# Altium schematic sheet Sheet3.SchDoc
size A3; DocumentNumber: 3; SheetNumber: 3; SheetTotal: 7
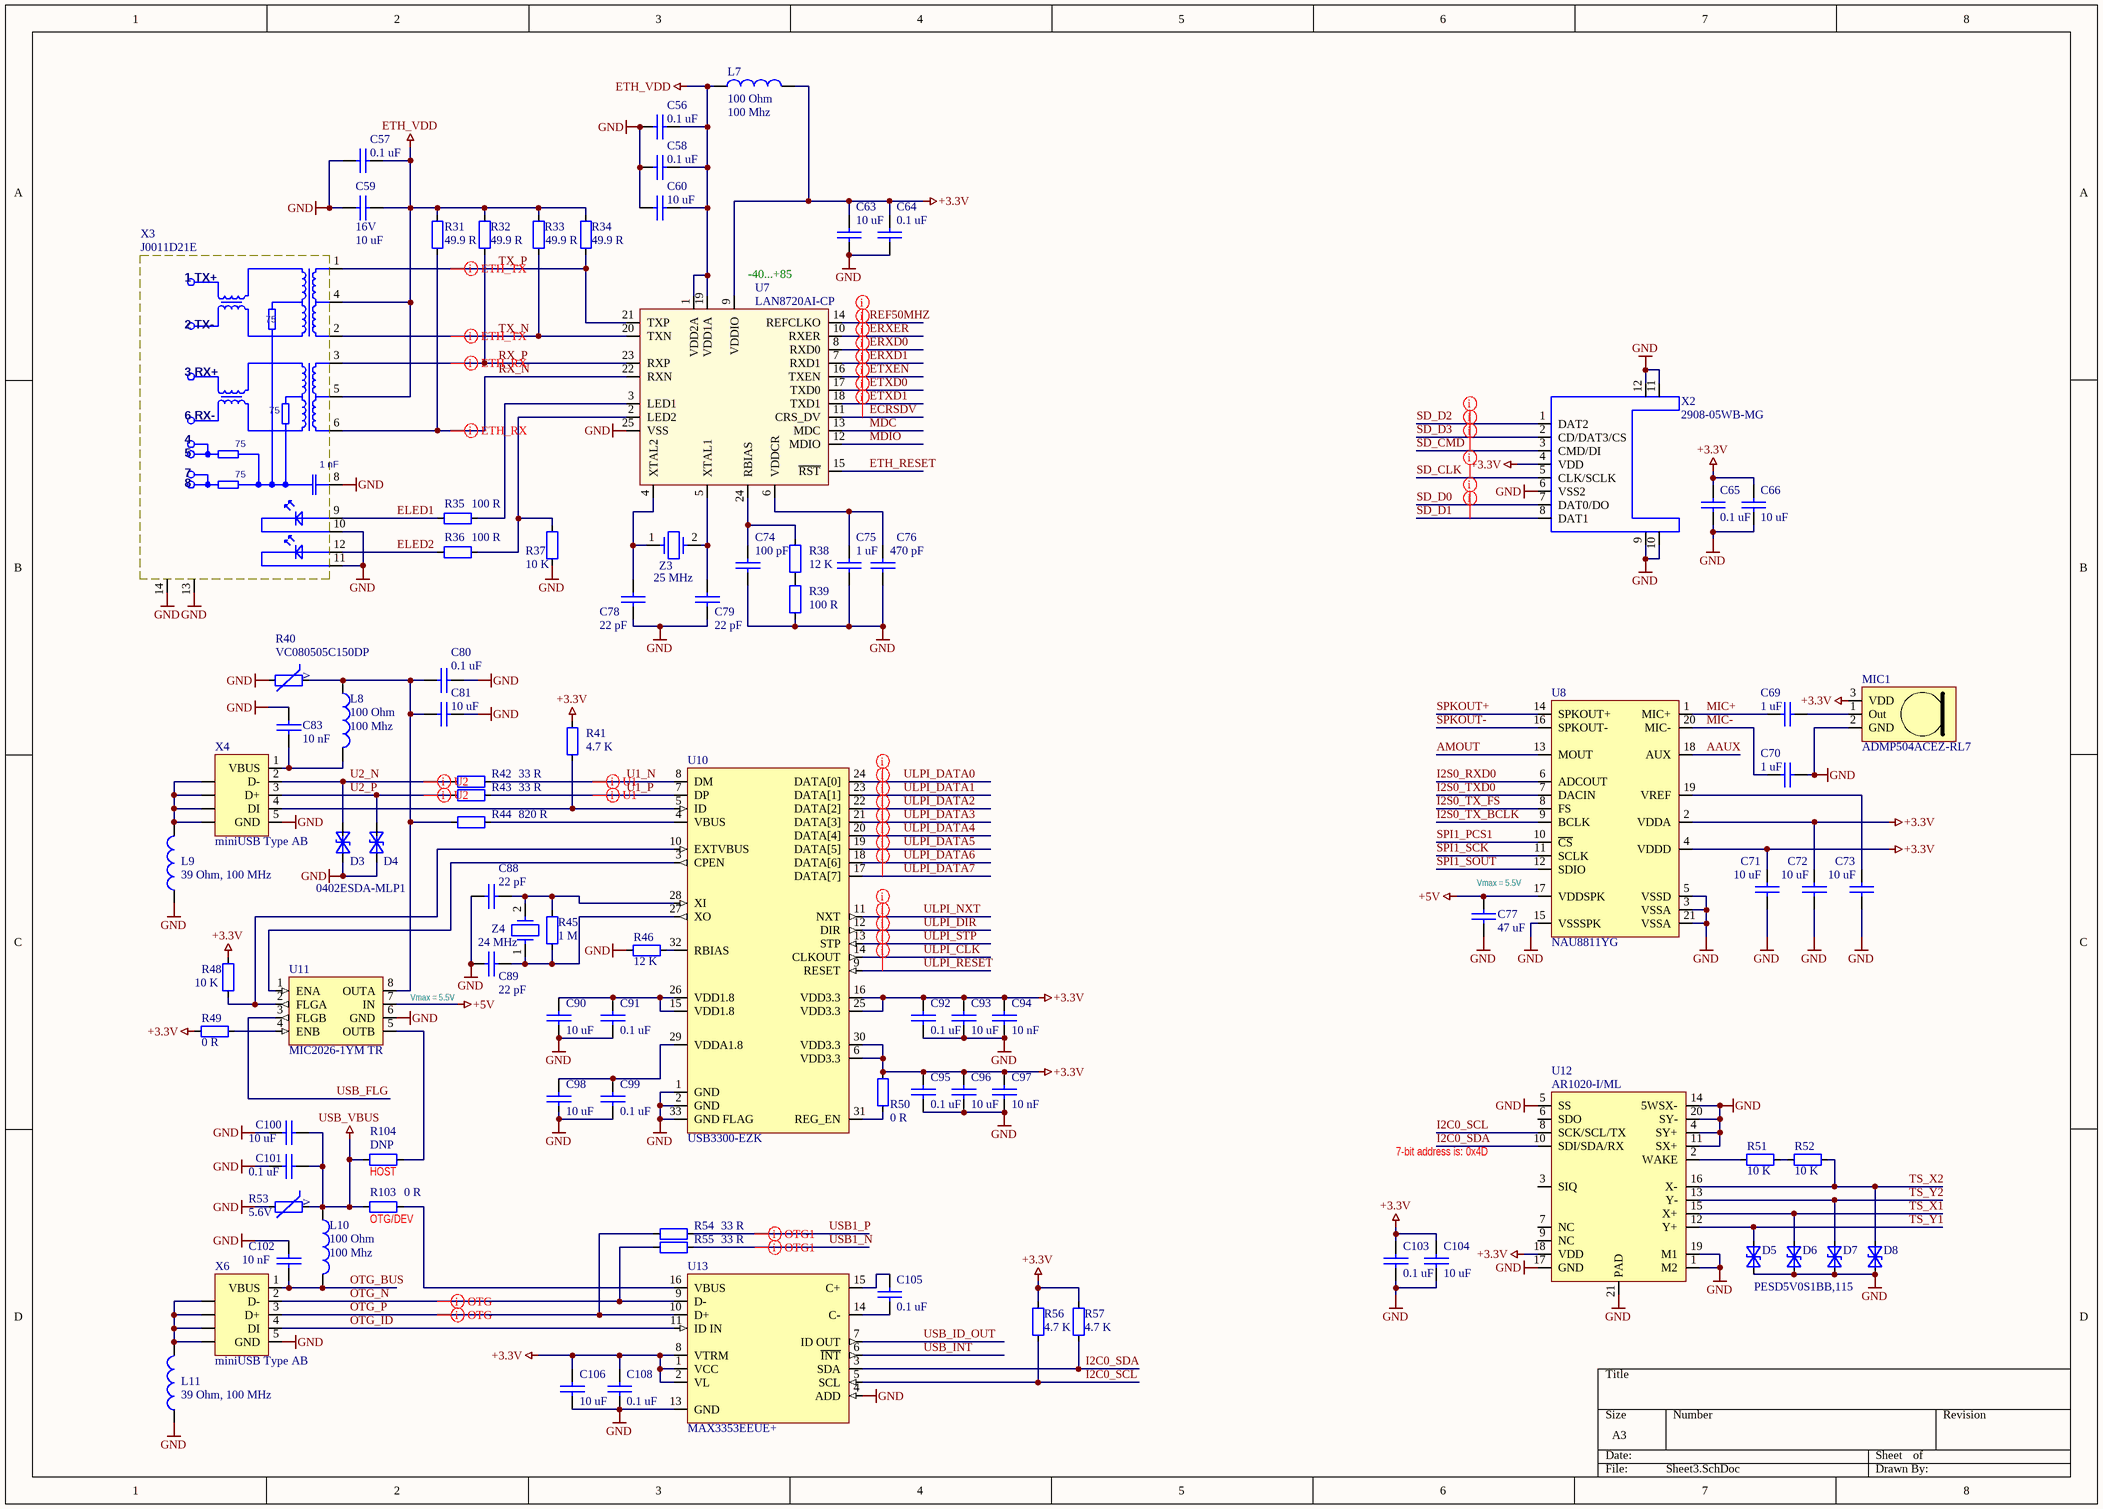
[diagram p0: Sheet3.SchDoc]

## Parts
C56  value 0.1 uF  [1608[0603]]  (hidden comment: CL10B104KA8NNND)
C57  value 0.1 uF  [1608[0603]]  (hidden comment: CL10B104KA8NNND)
C58  value 0.1 uF  [1608[0603]]  (hidden comment: CL10B104KA8NNND)
C59  value 10 uF  Voltage: 16V  [2012[0805]]  (hidden comment: C2012X5R1C106K085AC)
C60  value 10 uF  [2012[0805]]  (hidden comment: C2012X5R1C106K085AC)
C63  value 10 uF  [2012[0805]]  (hidden comment: C2012X5R1C106K085AC)
C64  value 0.1 uF  [1608[0603]]  (hidden comment: CL10B104KA8NNND)
C65  value 0.1 uF  [1608[0603]]  (hidden comment: CL10B104KA8NNND)
C66  value 10 uF  [2012[0805]]  (hidden comment: C2012X5R1C106K085AC)
C69  value 1 uF  [2012[0805]]  (hidden comment: GRM21BR71A105KA01L)
C70  value 1 uF  [2012[0805]]  (hidden comment: GRM21BR71A105KA01L)
C71  value 10 uF  [0805-1206]  (hidden comment: LMK212F106ZG-T)
C72  value 10 uF  [0805-1206]  (hidden comment: LMK212F106ZG-T)
C73  value 10 uF  [0805-1206]  (hidden comment: LMK212F106ZG-T)
C74  value 100 pF  [1608[0603]]  (hidden comment: CL10C101JB8NNNC)
C75  value 1 uF  [1608[0603]]  (hidden comment: CL10A105KO8NNNC)
C76  value 470 pF  [1608[0603]]  (hidden comment: CL10C471JB8NNNC)
C77  value 47 uF  [3225[1210]]  (hidden comment: GRM32ER71A476KE15L)
C78  value 22 pF  [1608[0603]]  (hidden comment: 0603N220J500CT)
C79  value 22 pF  [1608[0603]]  (hidden comment: 0603N220J500CT)
C80  value 0.1 uF  [1608[0603]]  (hidden comment: CL10B104KA8NNND)
C81  value 10 uF  [2012[0805]]  (hidden comment: C2012X5R1C106K085AC)
C83  value 10 nF  [1608[0603]]  (hidden comment: CL10B103JB8NNNC)
C88  value 22 pF  [1608[0603]]  (hidden comment: 0603N220J500CT)
C89  value 22 pF  [1608[0603]]  (hidden comment: 0603N220J500CT)
C90  value 10 uF  [2012[0805]]  (hidden comment: C2012X5R1C106K085AC)
C91  value 0.1 uF  [1608[0603]]  (hidden comment: CL10B104KA8NNND)
C92  value 0.1 uF  [1608[0603]]  (hidden comment: CL10B104KA8NNND)
C93  value 10 uF  [2012[0805]]  (hidden comment: C2012X5R1C106K085AC)
C94  value 10 nF  [1005[0402]]  (hidden comment: CL05B103KB5NNNC)
C95  value 0.1 uF  [1608[0603]]  (hidden comment: CL10B104KA8NNND)
C96  value 10 uF  [2012[0805]]  (hidden comment: C2012X5R1C106K085AC)
C97  value 10 nF  [1005[0402]]  (hidden comment: CL05B103KB5NNNC)
C98  value 10 uF  [2012[0805]]  (hidden comment: C2012X5R1C106K085AC)
C99  value 0.1 uF  [1608[0603]]  (hidden comment: CL10B104KA8NNND)
C100  value 10 uF  [2012[0805]]  (hidden comment: C2012X5R1C106K085AC)
C101  value 0.1 uF  [1608[0603]]  (hidden comment: CL10B104KA8NNND)
C102  value 10 nF  [1608[0603]]  (hidden comment: CL10B103JB8NNNC)
C103  value 0.1 uF  [1608[0603]]  (hidden comment: CL10B104KA8NNND)
C104  value 10 uF  [2012[0805]]  (hidden comment: C2012X5R1C106K085AC)
C105  value 0.1 uF  [1608[0603]]  (hidden comment: CL10B104KA8NNND)
C106  value 10 uF  [2012[0805]]  (hidden comment: C2012X5R1C106K085AC)
C108  value 0.1 uF  [1608[0603]]  (hidden comment: CL10B104KA8NNND)
D3  0402ESDA-MLP1  [0402]  (value not drawn)
D4  0402ESDA-MLP1  [0402]
D5  PESD5V0S1BB,115  [SOD523]
D6  PESD5V0S1BB,115  [SOD523]  (value not drawn)
D7  PESD5V0S1BB,115  [SOD523]  (value not drawn)
D8  PESD5V0S1BB,115  [SOD523]  (value not drawn)
L7  value 100 Ohm  Freq: 100 Mhz  [0603]  (hidden comment: MPZ1608D101B)
L8  value 100 Ohm  Freq: 100 Mhz  [0603]  (hidden comment: MPZ1608D101B)
L9  value 39 Ohm, 100 MHz  [0805]  (hidden comment: EXC-ML20A390U)
L10  value 100 Ohm  Freq: 100 Mhz  [0603]  (hidden comment: MPZ1608D101B)
L11  value 39 Ohm, 100 MHz  [0805]  (hidden comment: EXC-ML20A390U)
MIC1  ADMP504ACEZ-RL7  [ADMP504ACEZ]
R31  value 49.9 R  [0603]  (hidden comment: ERJ-3EKF49R9V)
R32  value 49.9 R  [0603]  (hidden comment: ERJ-3EKF49R9V)
R33  value 49.9 R  [0603]  (hidden comment: ERJ-3EKF49R9V)
R34  value 49.9 R  [0603]  (hidden comment: ERJ-3EKF49R9V)
R35  value 100 R  [0603]  (hidden comment: ERJ-3EKF1000V)
R36  value 100 R  [0603]  (hidden comment: ERJ-3EKF1000V)
R37  value 10 K  [0603]  (hidden comment: ERJ-3EKF1002V)
R38  value 12 K  [0603]  (hidden comment: RC0603FR-0712KL)
R39  value 100 R  [0603]  (hidden comment: ERJ-3EKF1000V)
R40  VC080505C150DP  [2012[0805]]
R41  value 4.7 K  [0603]  (hidden comment: RJ0603FRE074K7L)
R42  value 33 R  [0603]  (hidden comment: RC0603FR-0733RL)
R43  value 33 R  [0603]  (hidden comment: RC0603FR-0733RL)
R44  value 820 R  [0603]  (hidden comment: RC0603FR-07820RL)
R45  value 1 M  [0603]  (hidden comment: RC0603FR-071ML)
R46  value 12 K  [0603]  (hidden comment: RC0603FR-0712KL)
R48  value 10 K  [0603]  (hidden comment: ERJ-3EKF1002V)
R49  value 0 R  [0603]  (hidden comment: RC0603JR-070RL)
R50  value 0 R  [0603]  (hidden comment: RC0603JR-070RL)
R51  value 10 K  [0603]  (hidden comment: ERJ-3EKF1002V)
R52  value 10 K  [0603]  (hidden comment: ERJ-3EKF1002V)
R53  Voltage: 5.6V  [2012[0805]]  (hidden comment: VC080505C150DP)
R54  value 33 R  [0603]  (hidden comment: RC0603FR-0733RL)
R55  value 33 R  [0603]  (hidden comment: RC0603FR-0733RL)
R56  value 4.7 K  [0603]  (hidden comment: RJ0603FRE074K7L)
R57  value 4.7 K  [0603]  (hidden comment: RJ0603FRE074K7L)
R103  value 0 R  [0603]  (hidden comment: RC0603JR-070RL)
R104  value DNP  [0603]  (hidden comment: DNP_0603)  (no BOM)
U7  LAN8720AI-CP  [THIN QFN 24]
U8  NAU8811YG  [THIN QFN 20 W/O VIA]
U10  USB3300-EZK  [HVQFN32 NXP]
U11  MIC2026-1YM TR  [SO-8]
U12  AR1020-I/ML  [THIN QFN 20 W/O VIA]
U13  MAX3353EEUE+  [TSOP65P640-16AM]
X2  2908-05WB-MG  [2908-05WB-MG]
X3  J0011D21E  [PulseJack_J00]
X4  miniUSB Type AB  [USB AB 56579-0576 Molex]
X6  miniUSB Type AB  [USB AB 56579-0576 Molex]
Z3  value 25 MHz  [ABM3]  (hidden comment: ABM3-25.000MHZ-B2-T)
Z4  value 24 MHz  [ABM3]  (hidden comment: ABM3-24.000MHZ-B2-T)

## Nets
+3.3V: C63.2 C64.2 C65.1 C66.1 C71.2 C72.2 C92.2 C93.1 C94.2 C95.2 C96.1 C97.2 C103.1 C104.1 C106.2 C108.1 L7.2 MIC1.3(VDD) R41.2 R48.1 R49.2 R50.2 R56.2 R57.2 U7.9(VDDIO) U8.2(VDDA) U8.4(VDDD) U10.6(VDD3.3) U10.16(VDD3.3) U10.25(VDD3.3) U10.30(VDD3.3) U12.18(VDD) U13.1(VCC) U13.2(VL) U13.8(VTRM) X2.4(VDD)
+5V: C77.1 U8.17(VDDSPK) U11.7(IN)
ETH_VDD: C56.1 C57.1 C58.1 C59.1 C60.1 L7.1 R31.2 R32.2 R33.1 R34.1 U7.1(VDD2A) U7.19(VDD1A) X3.4(CT) X3.5(CT)
GND: C56.2 C57.2 C58.2 C59.2 C60.2 C63.1 C64.1 C65.2 C66.2 C70.2 C71.1 C72.1 C73.1 C74.2 C75.1 C76.2 C77.2 C78.2 C79.2 C80.2 C81.1 C83.2 C88.1 C89.1 C90.1 C91.2 C92.1 C93.2 C94.1 C95.1 C96.2 C97.1 C98.1 C99.2 C100.1 C101.2 C102.2 C103.2 C104.2 C106.1 C108.2 D3.1(C) D4.1(C) D5.2(A) D6.2(A) D7.2(A) D8.2(A) L9.1 L11.1 MIC1.2(GND) R37.2 R39.1 R40.1 R46.1 R53.1 U7.25(VSS) U8.3(VSSA) U8.5(VSSD) U8.15(VSSSPK) U8.21(VSSA) U10.1(GND) U10.2(GND) U10.33(GND_FLAG) U11.6(GND) U12.1(M2) U12.4(SY+) U12.5(SS) U12.11(SX+) U12.14(5WSX-) U12.17(GND) U12.19(M1) U12.20(SY-) U12.21(PAD) U13.4(ADD) U13.13(GND) X2.6(VSS2) X2.9 X2.10(WP) X2.11(GND) X2.12(GND) X3.8(GND) X3.10 X3.11 X3.13 X3.14 X4.5(GND) X6.5(GND)
USB_VBUS: C100.2 C101.1 L10.1 R53.2 R103.2 R104.1
AAUX: U8.18(AUX)
AMOUT: U8.13(MOUT)
ECRSDV: U7.11(CRS_DV)
ELED1: R35.1 X3.9
ELED2: R36.1 X3.12
ERXD0: U7.8(RXD0)
ERXD1: U7.7(RXD1)
ERXER: U7.10(RXER)
ETH_RESET: U7.15(~{RST})
ETXD0: U7.17(TXD0)
ETXD1: U7.18(TXD1)
ETXEN: U7.16(TXEN)
I2C0_SCL: R56.1 U12.8(SCK/SCL/TX) U13.5(SCL)
I2C0_SDA: R57.1 U12.10(SDI/SDA/RX) U13.3(SDA)
I2S0_RXD0: U8.6(ADCOUT)
I2S0_TX_BCLK: U8.9(BCLK)
I2S0_TX_FS: U8.8(FS)
I2S0_TXD0: U8.7(DACIN)
MDC: U7.13(MDC)
MDIO: U7.12(MDIO)
MIC+: C69.1 U8.1(MIC+)
MIC-: C70.1 U8.20(MIC-)
OTG_BUS: C102.1 L10.2 X6.1(VBUS)
OTG_ID: U13.11(ID_IN) X6.4(DI)
OTG_N: R55.1 U13.9(D-) X6.2(D-)
OTG_P: R54.1 U13.10(D+) X6.3(D+)
REF50MHZ: U7.14(REFCLKO)
RX_N: R31.1 U7.22(RXN) X3.6(RD-)
RX_P: R32.1 U7.23(RXP) X3.3(RD+)
SD_CLK: X2.5(CLK/SCLK)
SD_CMD: X2.3(CMD/DI)
SD_D0: X2.7(DAT0/DO)
SD_D1: X2.8(DAT1)
SD_D2: X2.1(DAT2)
SD_D3: X2.2(CD/DAT3/CS)
SPI1_PCS1: U8.10(~{CS})
SPI1_SCK: U8.11(SCLK)
SPI1_SOUT: U8.12(SDIO)
SPKOUT+: U8.14(SPKOUT+)
SPKOUT-: U8.16(SPKOUT-)
TS_X1: D6.1(C) U12.15(X+)
TS_X2: D8.1(C) R52.2 U12.16(X-)
TS_Y1: D5.1(C) U12.12(Y+)
TS_Y2: D7.1(C) U12.13(Y-)
TX_N: R33.2 U7.20(TXN) X3.2(TD-)
TX_P: R34.2 U7.21(TXP) X3.1(TD+)
U1_N: R42.2 U10.8(DM)
U1_P: R43.2 U10.7(DP)
U2_N: D3.2(A) R42.1 X4.2(D-)
U2_P: D4.2(A) R43.1 X4.3(D+)
ULPI_CLK: U10.14(CLKOUT)
ULPI_DATA0: U10.24(DATA[0])
ULPI_DATA1: U10.23(DATA[1])
ULPI_DATA2: U10.22(DATA[2])
ULPI_DATA3: U10.21(DATA[3])
ULPI_DATA4: U10.20(DATA[4])
ULPI_DATA5: U10.19(DATA[5])
ULPI_DATA6: U10.18(DATA[6])
ULPI_DATA7: U10.17(DATA[7])
ULPI_DIR: U10.12(DIR)
ULPI_NXT: U10.11(NXT)
ULPI_RESET: U10.9(RESET)
ULPI_STP: U10.13(STP)
USB1_N: R55.2
USB1_P: R54.2
USB_FLG: U11.3(FLGB)
USB_ID_OUT: U13.7(ID_OUT)
USB_INT: U13.6(~{INT})
NetC69_2: C69.2 MIC1.1(Out)
NetC73_2: C73.2 U8.19(VREF)
NetC74_1: C74.1 R38.2 U7.24(RBIAS)
NetC75_2: C75.2 C76.1 U7.6(VDDCR)
NetC78_1: C78.1 U7.4(XTAL2) Z3.1
NetC79_1: C79.1 U7.5(XTAL1) Z3.2
NetC80_1: C80.1 C81.2 L8.1 R40.2 R44.1 U11.8(OUTA)
NetC83_1: C83.1 L8.2 X4.1(VBUS)
NetC88_2: C88.2 R45.2 U10.28(XI) Z4.2
NetC89_2: C89.2 R45.1 U10.27(XO) Z4.1
NetC90_2: C90.2 C91.1 U10.15(VDD1.8) U10.26(VDD1.8)
NetC98_2: C98.2 C99.1 U10.29(VDDA1.8)
NetC105_1: C105.1 U13.15(C+)
NetC105_2: C105.2 U13.14(C-)
NetL9_2: L9.2 X4.S1(SHLD) X4.S2(SHLD) X4.S3(SHLD) X4.S4(SHLD)
NetL11_2: L11.2 X6.S1(SHLD) X6.S2(SHLD) X6.S3(SHLD) X6.S4(SHLD)
NetR35_2: R35.2 U7.3(LED1)
NetR36_2: R36.2 R37.1 U7.2(LED2)
NetR38_1: R38.1 R39.2
NetR41_1: R41.1 U10.5(ID) X4.4(DI)
NetR44_2: R44.2 U10.4(VBUS)
NetR46_2: R46.2 U10.32(RBIAS)
NetR48_2: R48.2 U10.10(EXTVBUS) U11.2(FLGA)
NetR49_1: R49.1 U11.4(ENB)
NetR50_1: R50.1 U10.31(REG_EN)
NetR51_1: R51.1 U12.2(WAKE)
NetR51_2: R51.2 R52.1
NetR103_1: R103.1 U13.16(VBUS)
NetR104_2: R104.2 U11.5(OUTB)
NetU10_3: U10.3(CPEN) U11.1(ENA)

Not connected (* = marked no-connect by the designer): U12 3(SIQ) 6(SDO) 7(NC) 9(NC)

## Layout directives
net class ETHERNET: ECRSDV, ERXD0, ERXD1, ERXER, ETXD0, ETXD1, ETXEN, REF50MHZ
net class SD_CARD: SD_CLK, SD_CMD, SD_D0, SD_D1, SD_D2, SD_D3
net class ULPI_DATA: ULPI_DATA0, ULPI_DATA1, ULPI_DATA2, ULPI_DATA3, ULPI_DATA4, ULPI_DATA5, ULPI_DATA6, ULPI_DATA7
net class ULPI_CTRL: ULPI_CLK, ULPI_DIR, ULPI_NXT, ULPI_RESET, ULPI_STP
differential pair: OTG_N, OTG_P, RX_N, RX_P, TX_N, TX_P, U1_N, U1_P, U2_N, U2_P, USB1_N, USB1_P

## Notes on the sheet
- (near U7) -40...+85
- Vmax = 5.5V
- (near R104) HOST
- (near U12) 7-bit address is: 0x4D
- (near R103) OTG/DEV
- (in symbol J0011D21E) 1 TX+; 2 TX-; 75; 3 RX+; 6 RX-; 1 nF; 7
- (in symbol VC080505C150D) V

## Library data of the parts
C56-C58 C64 C65 C80 C91 C92 C95 C99 C101 C103 C105 C108 = CVNF100K0603-25: 0.1 uF, 25V, 10% , X7R,  0603 SMD MLC Capacitor; Manufacturer: SAMSUNG; Tolerance: 10%; Distributor: Future; Price: 0.0026 Euro; Voltage: 25 V; PartNum: CL10B104KA8NNND; PartName: CL10B104KA8NNND; Price50: 0.0026 Euro; Price100: 0.0026 Euro; Price1000: 0.0026 Euro
C59 C60 C63 C66 C81 C90 C93 C96 C98 C100 C104 C106 = C2012X5R1C106K/0.85: 10 uF, 16V, X5R, ±10%, 0805; Manufacturer: TDK Corporation; Distributor: Future; Price: 0.0347 Euro; Tolerance: ±10%; PartNum: C2012X5R1C106K085AC; PartName: C2012X5R1C106K085AC; Price50: 0.0347 Euro; Price100: 0.0347 Euro; Price1000: 0.0347 Euro
  C60 C63 C66 C81 C90 C93 C96 C98 C100 C104 C106: Voltage: 16V
C69 C70 = GRM21BR71A105KA01L: 1 uF, 10V, 10%, X7R, 0805; Manufacturer: Murata; PartNum: 311-1458-1-ND; PartName: CC0805KKX7R6BB105; Tolerance: 10%; Price: 0.02$; Distributor: Mouser; Voltage: 10 V
C71-C73 = LMK212F106ZG-T: 10 uF, 10V, Y5V, -20%.. +80%, 0805; Manufacturer: Taiyo Yuden; PartNum: 587-1312-6-ND; Distributor: Digi-Key; Price: 0.11$; Tolerance: 20%.. +80%; Voltage: 10V; PartName: LMK212F106ZG-T
C74 = CCPF100K0603: 100 pF, 50V, 5%, NP0, 0603 SMD MLC Capacitor; Manufacturer: SAMSUNG; Tolerance: 5%; Price: 0.003$; Distributor: Future; PartNum: CL10C101JB8NNNC; Voltage: 50 V; PartName: CL10C101JB8NNNC; Price50: 0.003$; Price100: 0.003$; Price1000: 0.003$
C75 = GRM188R60J105KA01D: 1.0 uF, 16V, 10%, X5R, 0603; Manufacturer: SAMSUNG; Tolerance: 10%; Distributor: Future; Price: 0.0037 Euro; PartNum: CL10A105KO8NNNC; Voltage: 16 V; PartName: CL10A105KO8NNNC; Price50: 0.0037 Euro; Price100: 0.0037 Euro; Price1000: 0.0037 Euro
C76 = 06035A471JAT2A: 470 pF, 50V, 5%, C0G, NP0, -55°C ~ 125°C,0603 SMD MLC Capacitor; Manufacturer: SAMSUNG; Tolerance: 5%; Price: 0.003$; Distributor: Future; PartNum: CL10C471JB8NNNC; Voltage: 50 V; PartName: CL10C471JB8NNNC; Price50: 0.003$; Price100: 0.003$; Price1000: 0.003$
C77 = GRM32ER71A476KE15L: 47.0 uF, 10V, 10%, X7R, 1210; Manufacturer: Murata Electronics North America; PartNum: 490-5312-2-ND; Tolerance: 10%; Price: 3.3; Distributor: Digi-Key; Voltage: 10V; PartName: GRM32ER71A476KE15L
C78 C79 C88 C89 = CCPF022K0603: 22 pF, 50V, 5%, NP0, 0603 SMD MLC Capacitor; Manufacturer: WLS; Tolerance: 5%; Price: 0.0017$; Distributor: Future; PartNum: 0603N220J500CT; Voltage: 50 V; PartName: 0603N220J500CT; Price50: 0.0017$; Price100: 0.0017$; Price1000: 0.0017$
C83 C102 = CVNF010K0603: 10 nF, 50V, 5%, X7R, 0603 SMD MLC Capacitor; Manufacturer: SAMSUNG; Tolerance: 5%; Distributor: Future; Price: 0.0045 Euro; PartNum: CL10B103JB8NNNC; Voltage: 50 V; PartName: CL10B103JB8NNNC; Price50: 0.0045 Euro; Price100: 0.0045 Euro; Price1000: 0.0045 Euro
C94 C97 = GRM155R71C103KA01D: 10 nF, 16V, 10%, X7R, 0402; Manufacturer: SAMSUNG; Tolerance: 10%; Distributor: Future; Price: 0.02$; PartNum: CL05B103KB5NNNC; Voltage: 16 V; PartName: CL05B103KB5NNNC; Price50: 0.006$; Price100: 0.004$; Price1000: 0.003$
D3 D4 = 0402ESDA-MLP1: SUPPRESSOR ESD 30VDC 0402 HFREE; Manufacturer: Cooper Bussmann; PartNum: 283-2964-2-ND; Voltage: 30V; Distributor: Digi-Key; Price: 0.087$; PartName: 0402ESDA-MLP1
D5-D8 = PESD5V0S1BB,115: TVS DIODE 5VWM 14VC SOD523; Manufacturer: NXP Semiconductors; PartNum: 568-4054-2-ND; Voltage: 5V; Distributor: Digi-Key; Price: 0.1$; PartName: PESD5V0S1BB,115
L7 L8 L10 = MPZ1608D101B: FERRITE CHIP 100 OHM 1A 0603; Manufacturer: TDK Corporation; PartNum: 445-2988-2-ND; Distributor: Digi-Key; Price: 0.02$; PartName: MPZ1608D101B
L9 L11 = EXC-ML20A390U: Ferrite bead, 39 Ohm, 100 MHz,  4 A; Manufacturer: Panasonic - ECG; PartNum: P10191TR-ND; Ordered: Digi-Key; Distributor: Digi-Key; Price: 0.21$; PartName: EXC-ML20A390U; Price50: 0.17$; Price100: 0.15$; Price1000: 0.1$
MIC1 = ADMP504ACEZ-RL7: Mems Omni  -38dB ,  100Hz-20kHz, 200Ohm, 2 V, 65dB s/n, 225 uA; Manufacturer: Analog Devices Inc; PartNum: ADMP504ACEZ-RL7CT-ND; Distributor: DigiKey; Price: 4.52$; PartName: ADMP504ACEZ-RL7CT-ND
R31-R34 = CRCW060349R9FKEA: 49.9 R, 1%, 0.1 W, 0603, SMD Resistor, Taped; Manufacturer: PANASONIC; Voltage: 75 V; Distributor: Future; Price: 0.0015 Euro; Tolerance: 1%; PartNum: ERJ-3EKF49R9V; PartName: ERJ-3EKF49R9V; Price50: 0.0015 Euro; Price100: 0.0015 Euro; Price1000: 0.0015 Euro
R35 R36 R39 = RL0603E100-1: 100 R, 1%, 0603, SMD Resistor, Taped; Manufacturer: PANASONIC; Voltage: 75 V; Distributor: Future; Price: 0.0017$; Tolerance: 1%; PartNum: ERJ-3EKF1000V; PartName: ERJ-3EKF1000V; Price50: 0.0015 Euro; Price100: 0.0015 Euro; Price1000: 0.0015 Euro
R37 R48 R51 R52 = RL0603K010-1: 10 K, 1%, 0603, SMD Resistor, Taped; Manufacturer: PANASONIC; Voltage: 75 V; Distributor: Future; Price: 0.0015 Euro; Tolerance: 1%; PartNum: ERJ-3EKF1002V; PartName: ERJ-3EKF1002V; Price50: 0.0015 Euro; Price100: 0.0015 Euro; Price1000: 0.0015 Euro
R38 = RL0603K012-1: 12 K, 1%, 0603, SMD Resistor, Taped; Manufacturer: YAGEO AMERICA CORPORATION; Voltage: 75 V; Distributor: Farnell; Price: 0.0017$; Tolerance: 1%; PartNum: RC0603FR-0712KL; PartName: RC0603FR-0712KL; Price50: 0.0017$; Price100: 0.0017$; Price1000: 0.0017$
R40 = VC080505C150D: TVS, volt 5.6 V, Clamping voltage 18 V; Manufacturer: AVX Corporation; PartNum: 478-2507-1-ND; Voltage: 5.6V; Ordered: Digi-Key; Price: 0.81$; Distributor: Digi-Key; PartName: VC080505C150DP; Price50: 0.4$; Price100: 0.47$; Price1000: 0.38$
R41 R56 R57 = RL0603K004.7-1_1: 4.7 K, 1%, 0603, SMD Resistor, Taped; Manufacturer: YAGEO AMERICA CORPORATION; Voltage: 75 V; Distributor: Future; Price: 0.0017$; Tolerance: 1%; PartNum: RJ0603FRE074K7L; PartName: RJ0603FRE074K7L; Price50: 0.0017$; Price100: 0.0017$; Price1000: 0.0017$
R42 R43 R54 R55 = RL0603E033-1: 33 R, 1%, 0603, SMD Resistor, Taped; Manufacturer: YAGEO AMERICA CORPORATION; Voltage: 75 V; Distributor: Future; Price: 0.0017$; Tolerance: 1%; PartNum: RC0603FR-0733RL; PartName: RC0603FR-0733RL; Price50: 0.0017$; Price100: 0.0017$; Price1000: 0.0017$
R44 = RC0603FR-07820RL: 820 R, 1%, 0603, SMD Resistor, Taped; Manufacturer: YAGEO AMERICA CORPORATION; PartNum: 311-820HRTR-ND; Voltage: 75 V; Distributor: Digi-Key; Price: 0.0017$; Tolerance: 1%; PartName: RC0603FR-07820RL; Price50: 0.0017$; Price100: 0.0017$; Price1000: 0.0017$
R45 = RC0603FR-071ML: 1 M, 1%, 0603, SMD Resistor, Taped; Manufacturer: YAGEO AMERICA CORPORATION; Voltage: 75 V; Distributor: Future; Price: 0.002 Euro; Tolerance: 1%; PartNum: RC0603FR-071ML; PartName: RC0603FR-071ML
R46 = RL0603K012-1_1: 12 K, 1%, 0603, SMD Resistor, Taped; Manufacturer: YAGEO AMERICA CORPORATION; Voltage: 75 V; Distributor: Farnell; Price: 0.0017$; Tolerance: 1%; PartNum: RC0603FR-0712KL; PartName: RC0603FR-0712KL; Price50: 0.0017$; Price100: 0.0017$; Price1000: 0.0017$
R49 R50 R103 = RL0603E000: 0 R, 5%, 0603, SMD Resistor, Taped; Manufacturer: YAGEO AMERICA CORPORATION; Voltage: 75 V; Distributor: Future; Price: 0.0017$; Tolerance: 5%; PartNum: RC0603JR-070RL; PartName: RC0603JR-070RL; Price50: 0.0017$; Price100: 0.0017$; Price1000: 0.0017$
R53 = VC080505C150D: TVS, volt 5.6 V, Clamping voltage 18 V; Manufacturer: AVX Corporation; PartNum: 478-2507-1-ND; Ordered: Digi-Key; Price: 0.81$; Distributor: Digi-Key; PartName: VC080505C150DP; Price50: 0.4$; Price100: 0.47$; Price1000: 0.38$
R104 = DNP_0603: DNP, 0603
U7 = LAN8720AI-CP: TXRX PHY 10/100 1.6...3.6V, -40..85 C, 24-QFN; Manufacturer: Micrel Inc; PartNum: 886-LAN8720AI-CP; Ordered: Mouser; Distributor: Mouser; Price: 1.34 Euro; PartName: LAN8720AI-CP; Price50: 1.25 Euro; Price100: 0.98 Euro; Price1000: 0.86 Euro
U8 = NAU8811YG: Audio CODEC, Mono, Speaker Driver, QFN-20; Manufacturer: Nuvoton Technology; PartNum: NAU8811YG-ND; Distributor: Digi-Key; Price: 2.4$; PartName: NAU8811YG
U10 = USB3300-EZK: IC USB HOST/OTG PHY ULPI 32-QFN; Manufacturer: Microchip Technology; PartNum: 638-1034-ND; Distributor: DigiKey; Price: 1.24$; PartName: USB3300-EZK
U11 = MIC2026-1YM TR: Dual-Channel Power Distribution Switch, 8 Lead SOIC; Manufacturer: Micrel; PartNum: 576-1059-1-ND; Ordered: Future; Price: 0.59 Euro; Distributor: Future; PartName: MIC2026-1YM TR; Price50: 0.57 Euro; Price100: 0.76$; Price1000: 0.53$
U12 = AR1020-I/ML: IC TOUCH SCREEN CTRLR 20-QFN; Manufacturer: Microchip Technology; PartNum: AR1020-I/ML-ND; Distributor: DigiKey; Price: 2.3$; PartName: AR1020-I/ML
U13 = MAX3353EEUE+: IC CHARGE PUMP USB OTG 16TSSOP; Manufacturer: Maxim Integrated; PartNum: MAX3353EEUE+-ND; Distributor: DigiKey; Price: 2.82$; PartName: MAX3353EEUE+
X2 = 2908-05WB-MG: microSD cadr holder; Manufacturer: Amphenol Commercial Products; PartNum: 101-00660-68-6-1-ND; PartName: 101-00660-68-6; Ordered: Digi-Key; Price: 1.97$; Distributor: Digi-Key; Price50: 1.44$; Price100: 1.29$; Price1000: 1.06$
X3 = J0011D21E: 10/100 Base-TX RJ45 1x1 with LEDs 8-pin (J0 series); Manufacturer: Pulse; PartNum: 673-J0011D21E; Price: 3.74 $; Distributor: Mouser
X4 X6 = USB AB 56579-0576: SMD USB - OTG, miniUSB Type AB; Manufacturer: Molex/Waldom Electronics Corp; PartNum: WM17122CT-ND; Ordered: Digi-Key; Distributor: Digi-Key; Price: 2.81$; PartName: miniUSB Type AB; Price50: 2.43$; Price100: 1.83$; Price1000: 1.62$
Z3 = ABM3-25.000MHZ-B2-T: 25 MHz, 18 pF, 30 Ohm, ±50ppm, -20°C ~ 70°C; Manufacturer: Abracon Corporation; PartNum: 535-9108-1-ND; Price: 1$; Distributor: Digi-Key; Tolerance: 50 ppm; PartName: ABM3-25.000MHZ-B2-T
Z4 = ABM3-24.000MHZ-B2-T: 24 MHz, 18 pF, 30 Ohm, ±50ppm, -20°C ~ 70°C; Manufacturer: Abracon Corporation; PartNum: 535-9106-1-ND; Price: 1$; Distributor: Digi-Key; Tolerance: 50 ppm; PartName: ABM3-24.000MHZ-B2-T